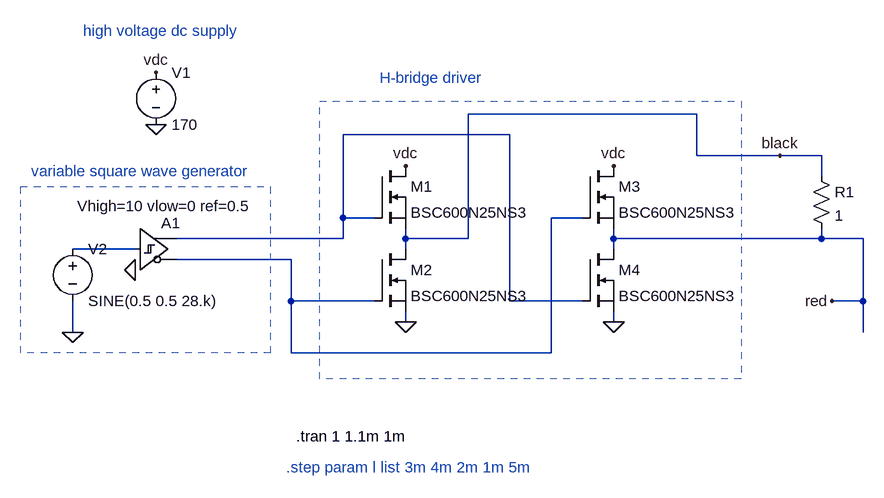
[diagram p0: schematic Draft3.asc]
Draft3.asc, the LTspice schematic file:
Version 4
SHEET 1 1112 680
WIRE 800 112 448 112
WIRE 512 144 256 144
WIRE 800 176 800 112
WIRE 928 176 800 176
WIRE 992 176 928 176
WIRE 992 208 992 176
WIRE 256 272 256 144
WIRE 304 272 256 272
WIRE 624 272 576 272
WIRE 256 304 256 272
WIRE 256 304 0 304
WIRE 352 304 352 288
WIRE 448 304 448 112
WIRE 448 304 352 304
WIRE 672 304 672 288
WIRE 992 304 992 288
WIRE 992 304 672 304
WIRE 1056 304 992 304
WIRE -64 320 -160 320
WIRE 352 320 352 304
WIRE 672 320 672 304
WIRE 176 336 0 336
WIRE 176 400 176 336
WIRE 304 400 176 400
WIRE 512 400 512 144
WIRE 624 400 512 400
WIRE 1056 400 1056 304
WIRE 1056 400 1008 400
WIRE 352 432 352 416
WIRE 672 432 672 416
WIRE -160 448 -160 400
WIRE 1056 448 1056 400
WIRE 176 480 176 400
WIRE 576 480 576 272
WIRE 576 480 176 480
FLAG -160 448 0
FLAG -64 352 0
FLAG -32 128 0
FLAG 352 432 0
FLAG -32 48 vdc
FLAG 352 192 vdc
FLAG 672 192 vdc
FLAG 672 432 0
FLAG 928 176 black
FLAG 1008 400 red
SYMBOL Digital/schmitt -64 256 R0
WINDOW 3 -89 -2 Left 2
SYMATTR InstName A1
SYMATTR Value Vhigh=10 vlow=0 ref=0.5
SYMBOL nmos 304 192 R0
SYMATTR InstName M1
SYMATTR Value BSC600N25NS3
SYMBOL nmos 304 320 R0
SYMATTR InstName M2
SYMATTR Value BSC600N25NS3
SYMBOL voltage -32 32 R0
SYMATTR InstName V1
SYMATTR Value 170
SYMBOL voltage -160 304 R0
SYMATTR InstName V2
SYMATTR Value SINE(0.5 0.5 28.k)
SYMATTR Value2 AC 1
SYMBOL nmos 624 192 R0
SYMATTR InstName M3
SYMATTR Value BSC600N25NS3
SYMBOL nmos 624 320 R0
SYMATTR InstName M4
SYMATTR Value BSC600N25NS3
SYMBOL res 976 192 R0
SYMATTR InstName R1
SYMATTR Value 1
TEXT 184 608 Left 2 !.tran 1 1.1m 1m
TEXT 168 656 Left 2 ;.step param l list 3m 4m 2m 1m 5m
TEXT -224 200 Left 2 ;variable square wave generator
TEXT 312 56 Left 2 ;H-bridge driver
TEXT -144 -16 Left 2 ;high voltage dc supply
RECTANGLE Normal 220 92 868 520 2
RECTANGLE Normal -240 224 144 480 2

The netlist it stands for:
* Draft3.asc
A1 N003 0 0 0 0 N002 N001 0 SCHMITT Vhigh=10 vlow=0 ref=0.5
M1 vdc N001 black black BSC600N25NS3
M2 black N002 0 0 BSC600N25NS3
V1 vdc 0 170
V2 N003 0 SINE(0.5 0.5 28.k) AC 1
M3 vdc N002 red red BSC600N25NS3
M4 red N001 0 0 BSC600N25NS3
R1 black red 1
.model NMOS NMOS
.model PMOS PMOS
.lib standard.mos
.tran 1 1.1m 1m
* .step param l list 3m 4m 2m 1m 5m
* variable square wave generator
* H-bridge driver
* high voltage dc supply
.backanno
.end